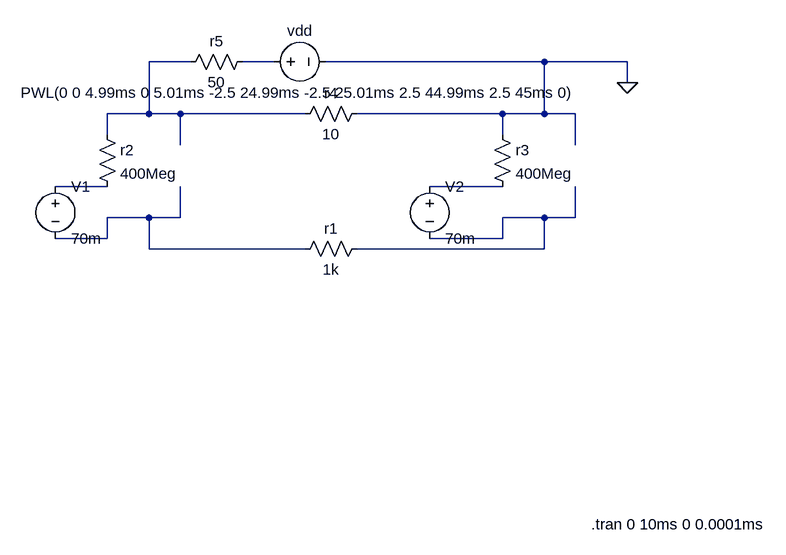
[diagram p0: schematic 電圧刺激等価回路_test.asc]
電圧刺激等価回路_test.asc, the LTspice schematic file:
Version 4
SHEET 1 1116 680
WIRE 192 -368 128 -368
WIRE 320 -368 272 -368
WIRE 736 -368 400 -368
WIRE 864 -368 736 -368
WIRE 864 -336 864 -368
WIRE 128 -288 128 -368
WIRE 128 -288 64 -288
WIRE 176 -288 128 -288
WIRE 368 -288 176 -288
WIRE 672 -288 448 -288
WIRE 736 -288 736 -368
WIRE 736 -288 672 -288
WIRE 784 -288 736 -288
WIRE 64 -256 64 -288
WIRE 672 -256 672 -288
WIRE 176 -240 176 -288
WIRE 784 -240 784 -288
WIRE 64 -176 -16 -176
WIRE 672 -176 560 -176
WIRE 128 -128 64 -128
WIRE 176 -128 176 -176
WIRE 176 -128 128 -128
WIRE 736 -128 672 -128
WIRE 784 -128 784 -176
WIRE 784 -128 736 -128
WIRE 64 -96 64 -128
WIRE 64 -96 -16 -96
WIRE 672 -96 672 -128
WIRE 672 -96 560 -96
WIRE 128 -80 128 -128
WIRE 368 -80 128 -80
WIRE 736 -80 736 -128
WIRE 736 -80 448 -80
FLAG 864 -336 0
SYMBOL voltage 304 -368 R270
WINDOW 0 32 56 VTop 2
WINDOW 3 -32 56 VBottom 2
WINDOW 123 0 0 Left 0
WINDOW 39 0 0 Left 0
SYMATTR InstName vdd
SYMATTR Value PWL(0 0 4.99ms 0 5.01ms -2.5 24.99ms -2.5 25.01ms 2.5 44.99ms 2.5 45ms 0)
SYMBOL res 48 -272 R0
SYMATTR InstName r2
SYMATTR Value 400Meg
SYMBOL res 464 -96 R90
WINDOW 0 0 56 VBottom 2
WINDOW 3 32 56 VTop 2
SYMATTR InstName r1
SYMATTR Value 1k
SYMBOL res 656 -272 R0
SYMATTR InstName r3
SYMATTR Value 400Meg
SYMBOL res 464 -304 R90
WINDOW 0 0 56 VBottom 2
WINDOW 3 32 56 VTop 2
SYMATTR InstName r4
SYMATTR Value 10
SYMBOL voltage -16 -192 R0
SYMATTR InstName V1
SYMATTR Value 70m
SYMBOL voltage 560 -192 R0
WINDOW 123 0 0 Left 0
WINDOW 39 0 0 Left 0
SYMATTR InstName V2
SYMATTR Value 70m
SYMBOL res 288 -384 R90
WINDOW 0 0 56 VBottom 2
WINDOW 3 32 56 VTop 2
SYMATTR InstName r5
SYMATTR Value 50
TEXT 808 344 Left 2 !.tran 0 10ms 0 0.0001ms

The netlist it stands for:
* 電圧刺激等価回路_test.asc
vdd N002 0 PWL(0 0 4.99ms 0 5.01ms -2.5 24.99ms -2.5 25.01ms 2.5 44.99ms 2.5 45ms 0)
r2 N001 N003 400Meg
r1 N006 N005 1k
r3 0 N004 400Meg
r4 0 N001 10
V1 N003 N005 70m
V2 N004 N006 70m
r5 N002 N001 50
.tran 0 10ms 0 0.0001ms
.backanno
.end